# Altium schematic sheet CAN_USB_DISPLAY.SchDoc
size A; SheetNumber: 3; SheetTotal: 4
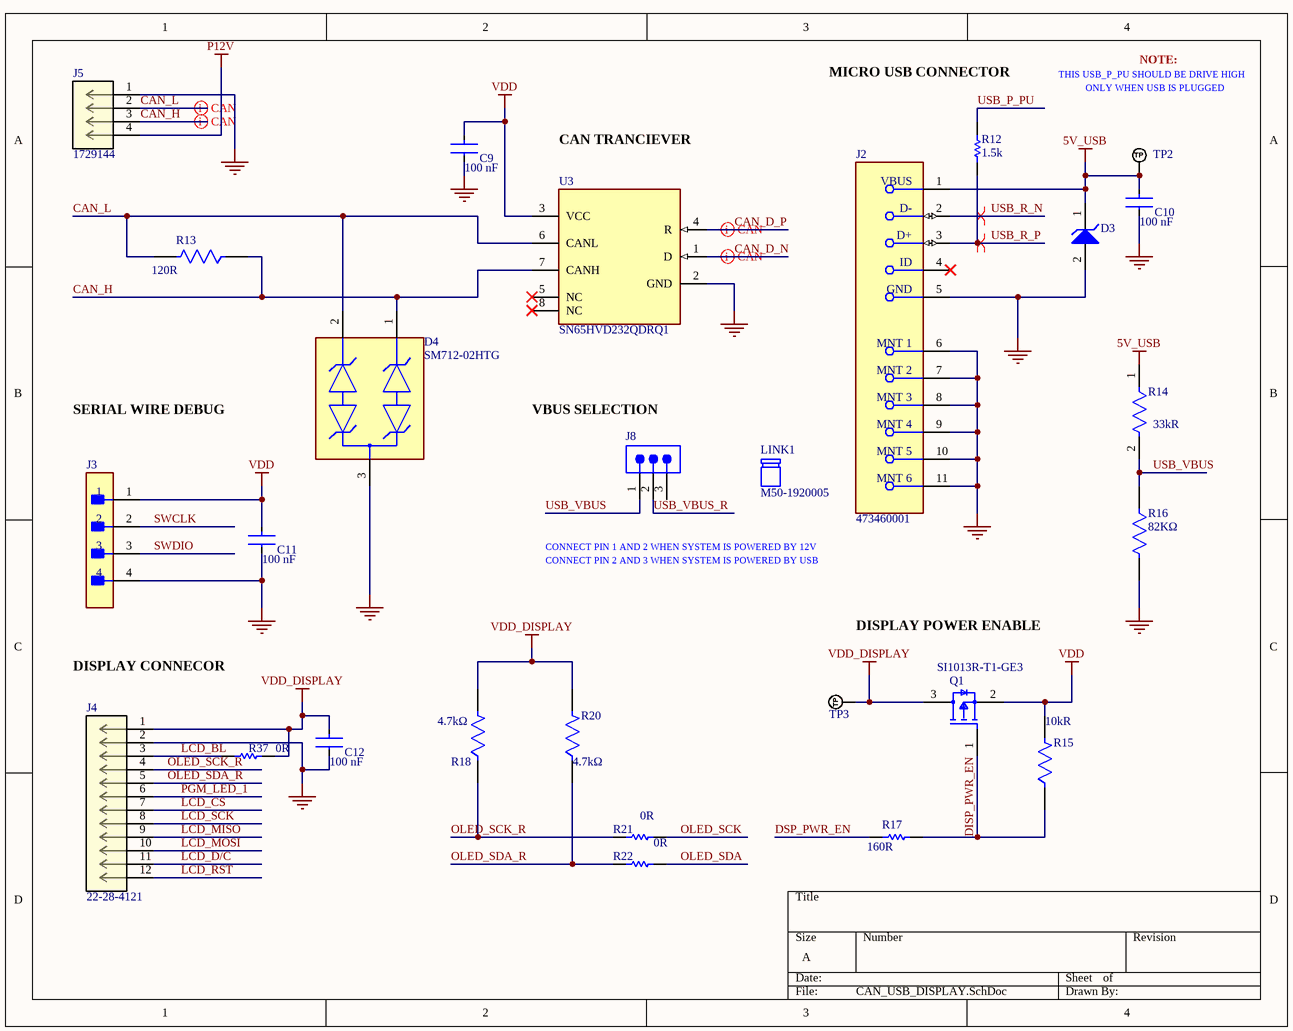
[diagram p0: CAN_USB_DISPLAY.SchDoc]

## Parts
C9  Capacitance: 100 nF  [FP-CC0402-MFG]  (hidden comment: CC0402KRX7R7BB104)
C10  Capacitance: 100 nF  [FP-CC0402-MFG]  (hidden comment: CC0402KRX7R7BB104)
C11  Capacitance: 100 nF  [FP-CC0402-MFG]  (hidden comment: CC0402KRX7R7BB104)
C12  Capacitance: 100 nF  [FP-CC0402-MFG]  (hidden comment: CC0402KRX7R7BB104)
D3  ESD5Z5.0T1G  [ONSC-SOD-523-2-502-01_V]  (value not drawn)
D4  SM712-02HTG  [FP-SM712-MFG]
J2  473460001  [FP-473460001-MFG]
J3  HTSW-104-07-G-S  [FP-HTSW-104-07-G-S-MFG]  (value not drawn)
J4  22-28-4121  [12 POS_2.54MM_MOLEX]
J5  1729144  [PHOENIX_1729144]
J8  61300311121  [61300311121]  (value not drawn)
LINK1  M50-1920005  (mechanical)
Q1  SI1013R-T1-GE3  [FP-C15-1445-MFG]
R12  Resistance: 1.5k  [RESC1005X40X25LL10T10]  (hidden comment: ERA2AEB152X)
R13  RESISTANCE: 120R  [FP-RMCF1206-MFG]  (hidden comment: RMCF1206FTR120)
R14  Resistance: 33kR  [FP-ERA2A-MFG]  (hidden comment: ERA-2AEB333X)
R15  Resistance: 10kR  [FP-RC0402-0_4-MFG]  (hidden comment: RC0402JR-0710KL)
R16  Resistance: 82KΩ  [FP-CRGCQ0402-IPC_C]  (hidden comment: CRGCQ0402F82K)
R17  Resistance: 160R  [RESC1005X40X25NL05T05]  (hidden comment: ERJ-2GEJ161X)
R18  Resistance: 4.7kΩ  [FP-RC0402-0_4-MFG]  (hidden comment: RC0402JR-074K7L)
R20  Resistance: 4.7kΩ  [FP-RC0402-0_4-MFG]  (hidden comment: RC0402JR-074K7L)
R21  Resistance: 0R  [RESC1005X40X25LL05T05]  (hidden comment: ERJ2GE0R00X)
R22  Resistance: 0R  [RESC1005X40X25LL05T05]  (hidden comment: ERJ2GE0R00X)
R37  Resistance: 0R  [RESC1005X40X25LL05T05]  (hidden comment: ERJ2GE0R00X)
TP2  TP_NOBOM  [PAD_RND_1MM]  (value not drawn)  (no BOM)
TP3  TP_NOBOM  [PAD_RND_1MM]  (value not drawn)  (no BOM)
U3  SN65HVD232QDRQ1  [CAN IC]

## Nets
5V_USB: C10.1 D3.1(K) J2.1(VBUS) R14.1 TP2.1(TP)
GND: C9.2 C10.2 C11.2 C12.2 D3.2(A) D4.3 J2.5(GND) J2.6(MNT_1) J2.7(MNT_2) J2.8(MNT_3) J2.9(MNT_4) J2.10(MNT_5) J2.11(MNT_6) J3.4 J4.2 J5.1 R16.2 U3.2(GND)
P12V: J5.4
VDD: C9.1 C11.1 J3.1 Q1.2(S) R15.2 U3.3(VCC)
VDD_DISPLAY: C12.1 J4.1 Q1.3(D) R18.2 R20.2 R37.2 TP3.1(TP)
CAN_D_N: U3.1(D)
CAN_D_P: U3.4(R)
CAN_H: D4.1 J5.3 R13.1 U3.7(CANH)
CAN_L: D4.2 J5.2 R13.2 U3.6(CANL)
DISP_PWR_EN: Q1.1(G) R15.1 R17.2
DSP_PWR_EN: R17.1
LCD_BL: J4.3 R37.1
LCD_CS: J4.7
LCD_D/C: J4.11
LCD_MISO: J4.9
LCD_MOSI: J4.10
LCD_RST: J4.12
LCD_SCK: J4.8
OLED_SCK: R21.2
OLED_SCK_R: J4.4 R18.1 R21.1
OLED_SDA: R22.2
OLED_SDA_R: J4.5 R20.1 R22.1
PGM_LED_1: J4.6
SWCLK: J3.2
SWDIO: J3.3
USB_P_PU: R12.2
USB_R_N: J2.2(D-)
USB_R_P: J2.3(D+) R12.1
USB_VBUS: J8.1 R14.2 R16.1
USB_VBUS_R: J8.2

Not connected (* = marked no-connect by the designer): J2 4(ID)*; J8 3; U3 5(NC)* 8(NC)*

## Layout directives
differential pair; differential pair class DIFF USB: USB_R_N, USB_R_P
differential pair; DIFF PAIR CLASS NAME: DIFF CAN: CAN_D_N, CAN_D_P, CAN_H, CAN_L

## Notes on the sheet
- MICRO USB CONNECTOR
- THIS USB_P_PU SHOULD BE DRIVE HIGH
- ONLY WHEN USB IS PLUGGED
- NOTE:
- CAN TRANCIEVER
- SERIAL WIRE DEBUG
- VBUS SELECTION
- CONNECT PIN 1 AND 2 WHEN SYSTEM IS POWERED BY 12V
- CONNECT PIN 2 AND 3 WHEN SYSTEM IS POWERED BY USB
- DISPLAY POWER ENABLE
- DISPLAY CONNECOR

## Library data of the parts
C9-C12 = CMP-03422-000048-1: CAP CER 0.1UF 16V X7R 0402; Manufacturer: YAGEO; Material: Ceramic; Automotive Grade: NA; Temperature Coefficient: 30ppm/°C; Tolerance: 0.1; Value: 100 nF; Device Class L1: Passive Components; Temperature Range Low: -55°C; Device Class L3: Ceramic Capacitors; Temperature Characteristic: X7R; Ipc Land Pattern Name: CAPC10050X50; Temperature Range High: +125°C; Voltage Rating: 16 V; Temperature: -55°C to +125°C; RoHS: TRUE; Automotive: No; Height: 0.55mm; Device Class L2: Capacitors; Digikey Description: CAP CER 0.1UF 16V X7R 0402; Package: CC0402; Footprint Url: http://www.yageo.com/exep/pages/download/literatures/UPY-C_GEN_24.pdf; ComponentLink2Description: Datasheet; Category: Cap; Lead Free: Yes; Octopart: https://octopart.com/cc0402krx7r7bb104-yageo-42244624; ComponentLink2URL: http://www.yageo.com/documents/recent/UPY-GP_NP0_16V-to-50V_16.pdf; Manufacturer Part Number: CC0402KRX7R7BB104; Mouser Description: 0402 0.1 uF 16 V ±10 % Tolerance X7R SMT Multilayer Ceramic Capacitor
D3 = CMP-1063-00102-1: Transient Voltage Suppressor, Micro-Packaged Diode for ESD Protection, 2-Pin SOD-523, Pb-Free, Tape and Reel; Manufacturer: On Semiconductor; V(BR) Min (V): 6.2; VRWM Max (V): 5; Number of Lines: 1; PPK Max (W): 174; IR Max (uA): 0.05; Direction: Unidirectional; PackageVersion: Rev. E, 09/2010; Mounting Technology: Surface Mount; Packing: Tape and Reel; ComponentLink2URL: http://www.onsemi.cn/pub_link/Collateral/ESD5Z2.5T1-D.PDF; ComponentLink2Description: Datasheet; PackageReference: SOD-523-2-502-01; ComponentLink1Description: Manufacturer URL; ComponentLink3URL: http://www.onsemi.com/pub_link/Collateral/502-01.PDF; PackageDescription: 2-Pin SOD, Body 1.2 x 0.8 mm; ComponentLink3Description: Package Specification; ComponentLink1URL: http://www.onsemi.com/; RoHS: Pb-Free; PartNumber: ESD5Z5.0T1G; DatasheetVersion: Rev. 10
D4 = CMP-2000-07561-2: TVS DIODE 12V 31V SOT23-3; Leakage Current: 20uA; Polarity: Bidirectional; Breakdown Voltage: 13.3V; Max Power Dissipation: 600W; Number of Channels: 2; Max Surge Current: 19A; Capacitance: 75pF; Power Line Protection: No; Element Configuration: Dual; Number of Pins: 3; Radiation Hardening: No; Clamping Voltage: 31V; Mount: Surface Mount; Reverse Standoff Voltage: 12V; Peak Pulse Power: 600W; Lead Free: Lead Free; Direction: Bidirectional; Packaging: Tape and Reel; Case/Package: SOT-23-3; Number of Bidirectional Channels: 2; Termination: SMD/SMT; Max Operating Temperature: 125°C; Min Breakdown Voltage: 13.3V; Depth: 1.4mm; Package Quantity: 3000; Working Voltage: 12V; Length: 3.04mm; Peak Pulse Current: 19A; Composition: Zener; Min Operating Temperature: -40°C
J2 = CMP-2000-05246-2: CONN RCPT USB2.0 MICRO B SMD R/A; Manufacturer: Molex; Conn Orientation: Right Angle; Is Female: yes; Shielding: true; Pitch: 0.65mm; Number Of Contacts: 5; Voltage Rating: 30V; Current Rating: 1.8A; Device Class L2: USB Connectors; Digikey Description: CONN RCPT USB2.0 MICRO B SMD R/A; Height: 2.945mm; RoHS: TRUE; ComponentLink2Description: Datasheet; Octopart: https://octopart.com/47346-0001-molex-7164928; Automotive: No; Package: 0; Category: Conn; Device Class L1: Connectors; Usb Standard: USB 2.0; Temperature: -30°C to +85°C; Temperature Range Low: -30°C; Footprint Url: https://www.molex.com/pdm_docs/sd/473460001_sd.pdf; ComponentLink2URL: https://www.molex.com/webdocs/datasheets/pdf/en-us/0473460001_IO_CONNECTORS.pdf; Lead Free: Yes; Manufacturer Part Number: 473460001; Contact Material: Gold,Nickel; Temperature Range High: +85°C; Device Class L3: unset
J3 = CMP-02766-001776-1: CONN HEADER VERT 4POS 2.54MM; Gender: Male; Number of Contacts: 4; Packaging: Bulk; RoHS Compliant: Yes; Number of Rows: 1; Mount: Through Hole; Contact Material: Bronze; Series: HTSW; Radiation Hardening: No; Pitch: 2.54mm; Reach SVHC Compliant: Yes; Contact Plating: Gold; Termination: Through Hole
J4 = 22-28-4121: KK 254 Breakaway Header, Vertical, 12 Circuits, Tin (Sn) Plating, Mating Pin Length 8.13mm; Manufacturer: Molex; Manufacturer Lifecycle Status: ACTIVE; Connector Type: Male Pin; Contact Resistance: 20mΩ; Current Rating: 4A; Gender: Male; Insulation Resistance: 50GΩ; Max Voltage Rating (AC): 250V; Number of Circuits: 12; Pitch: 2.54mm; Supplier: Farnell; Supplier Part Number: 4232426; Manufacturer Part Number: 22-28-4121; RoHS: Compliant; Category: Headers and Wire Housings; Stock: 4391; Pricing: 300=0.506, 900=0.491 (EUR); China RoHS: Compliant; Color: Black; Contact Gender: Male; Contact Material: Bronze; Contact Mating Length: 8.128mm; Contact Plating: Tin; Country of Origin: US; Depth: 2.49mm; Housing Color: Black; Housing Material: Thermoplastic; Lead Free: Lead Free; Length: 30.48mm; Lifecycle Status: Production; Max Operating Temperature: 75°C; Min Operating Temperature: -40°C; Mounting Technology: Through Hole; Number of Contacts: 12; Pins: 12; Number of Positions: 12; Number of Rows: 1; Orientation: Vertical; Packaging: Bulk; Plating: Tin; REACH SVHC: Yes; Terminal Pitch: 2.54mm; Termination: Solder; ComponentLink1URL: https://datasheet.octopart.com:443/22-28-4121-Molex-datasheet-166051265.pdf?src-supplier=IHS; ComponentLink1Description: https://datasheet.octopart.com:443/22-28-4121-Molex-datasheet-166051265.pdf?src-supplier=IHS; ComponentLink2URL: https://datasheet.octopart.com:443/22-28-4121-Molex-datasheet-16300599.pdf?src-supplier=Molex; ComponentLink2Description: https://datasheet.octopart.com:443/22-28-4121-Molex-datasheet-16300599.pdf?src-supplier=Molex; ComponentLink3URL: https://sigma.octopart.com:443/16300370/technical_drawing/Molex-22-28-4121.pdf?src-supplier=Molex; ComponentLink3Description: https://sigma.octopart.com:443/16300370/technical_drawing/Molex-22-28-4121.pdf?src-supplier=Molex; ComponentLink4URL: https://datasheet.octopart.com:443/022284121-Molex-datasheet-8334776.pdf?src-supplier=Molex; ComponentLink4Description: https://datasheet.octopart.com:443/022284121-Molex-datasheet-8334776.pdf?src-supplier=Molex; ComponentLink5URL: https://datasheet.octopart.com:443/22-28-4121-Molex-datasheet-147975.pdf?src-supplier=DigiKey; ComponentLink5Description: https://datasheet.octopart.com:443/22-28-4121-Molex-datasheet-147975.pdf?src-supplier=DigiKey; ComponentLink6URL: http://sigma.octopart.com:80/16300600/rohs_statement/Molex-22-28-4121.pdf?src-supplier=Compliance+Statements; ComponentLink6Description: http://sigma.octopart.com:80/16300600/rohs_statement/Molex-22-28-4121.pdf?src-supplier=Compliance+Statements; ComponentLink7URL: http://sigma.octopart.com:80/conflict_mineral_statement/Molex-company-72.pdf?src-supplier=Compliance+Statements; ComponentLink7Description: http://sigma.octopart.com:80/conflict_mineral_statement/Molex-company-72.pdf?src-supplier=Compliance+Statements; ComponentLink8URL: http://sigma.octopart.com:80/rohs_statement/Molex-company-73.pdf?src-supplier=Compliance+Statements; ComponentLink8Description: http://sigma.octopart.com:80/rohs_statement/Molex-company-73.pdf?src-supplier=Compliance+Statements; ComponentLink9URL: http://sigma.octopart.com:80/reach_statement/Molex-company-74.pdf?src-supplier=Compliance+Statements; ComponentLink9Description: http://sigma.octopart.com:80/reach_statement/Molex-company-74.pdf?src-supplier=Compliance+Statements
J5 = 1729144: Block, Terminal; 13.5 A; 250 V; 5.08 mm; 26 to 16 AWG; 4; Screw; Solder; 4 kV; Manufacturer: Phoenix Contact; Approvals: CB, CSA, cUL; Current: 10A; Current Rating: 13.5A; Max Supply Voltage: 250V; Number of Circuits: 4; Number of Levels: 1; Pitch: 5.08mm; Stripping Length: 6mm; Test Voltage: 4kV; Voltage: 300V; Voltage Rating: 400V; Wire/Cable Gauge: 16AWG; Wire Gauge (Max): 26AWG; Supplier: RS; Supplier Part Number: 2901264; Manufacturer Part Number: 1729144; RoHS: Compliant; Category: Terminal Blocks; Stock: 210; Pricing: 5=1.936, 125=1.748, 375=1.65, 1000=1.462, 2000=1.352 (EUR); China RoHS: Compliant; Color: Green; Connector Type: Screw; Contact Material: Tin; Depth: 8.1mm; Flammability Rating: UL94 V-0; Height: 10.15mm; Housing Color: Green; Insulation Material: Nylon; Lead Free: Lead Free; Lead Pitch: 5.08mm; Length: 20.32mm; Lifecycle Status: Production; Max Current Rating: 13.5A; Max Operating Temperature: 100°C; Min Operating Temperature: -20°C; Mounting Technology: Screw; Number of Contacts: 4; Pins: 4; Number of Poles: 4; Number of Positions: 4; Number of Positions Per Level: 4; Number of Rows: 1; Orientation: Straight; Packaging: Bulk; Radiation Hardening: No; REACH SVHC: No; Termination: Screw; Voltage Rating (AC): 250V; Weight: 3.679995g; Width: 10mm; Wire Gauge (Min): 26AWG; ComponentLink1URL: https://datasheet.octopart.com:443/1729144-Phoenix-Contact-datasheet-181074908.pdf?src-supplier=IHS; ComponentLink1Description: https://datasheet.octopart.com:443/1729144-Phoenix-Contact-datasheet-181074908.pdf?src-supplier=IHS; ComponentLink2URL: https://datasheet.octopart.com:443/1729144-Phoenix-Contact-datasheet-83960592.pdf?src-supplier=element14+APAC; ComponentLink2Description: https://datasheet.octopart.com:443/1729144-Phoenix-Contact-datasheet-83960592.pdf?src-supplier=element14+APAC; ComponentLink3URL: https://datasheet.octopart.com:443/1729144-Phoenix-Contact-datasheet-20682991.pdf?src-supplier=Newark; ComponentLink3Description: https://datasheet.octopart.com:443/1729144-Phoenix-Contact-datasheet-20682991.pdf?src-supplier=Newark; ComponentLink4URL: https://datasheet.octopart.com:443/1729144-Phoenix-Contact-datasheet-21212956.pdf?src-supplier=Newark; ComponentLink4Description: https://datasheet.octopart.com:443/1729144-Phoenix-Contact-datasheet-21212956.pdf?src-supplier=Newark; ComponentLink5URL: https://datasheet.octopart.com:443/1729144-Phoenix-Contact-datasheet-169855811.pdf?src-supplier=Master+Electronics; ComponentLink5Description: https://datasheet.octopart.com:443/1729144-Phoenix-Contact-datasheet-169855811.pdf?src-supplier=Master+Electronics; ComponentLink6URL: https://datasheet.octopart.com:443/1729144-Phoenix-Contact-datasheet-154778803.pdf?src-supplier=Electro+Sonic; ComponentLink6Description: https://datasheet.octopart.com:443/1729144-Phoenix-Contact-datasheet-154778803.pdf?src-supplier=Electro+Sonic; ComponentLink7URL: https://datasheet.octopart.com:443/1729144-Phoenix-Contact-datasheet-9657250.pdf?src-supplier=TodayComponents; ComponentLink7Description: https://datasheet.octopart.com:443/1729144-Phoenix-Contact-datasheet-9657250.pdf?src-supplier=TodayComponents; ComponentLink8URL: https://datasheet.octopart.com:443/1729144-Phoenix-Contact-datasheet-177321331.pdf?src-supplier=Burklin+Elektronik; ComponentLink8Description: https://datasheet.octopart.com:443/1729144-Phoenix-Contact-datasheet-177321331.pdf?src-supplier=Burklin+Elektronik; ComponentLink9URL: https://datasheet.octopart.com:443/1729144-Phoenix-Contact-datasheet-33458667.pdf?src-supplier=MRO+Stop; ComponentLink9Description: https://datasheet.octopart.com:443/1729144-Phoenix-Contact-datasheet-33458667.pdf?src-supplier=MRO+Stop; ComponentLink10URL: https://datasheet.octopart.com:443/1729144-Phoenix-Contact-datasheet-11779056.pdf?src-supplier=Arrow+Electronics; ComponentLink10Description: https://datasheet.octopart.com:443/1729144-Phoenix-Contact-datasheet-11779056.pdf?src-supplier=Arrow+Electronics; ComponentLink11URL: https://datasheet.octopart.com:443/1729144-Phoenix-Contact-datasheet-62122477.pdf?src-supplier=RS+(Formerly+Allied+Electronics); ComponentLink11Description: https://datasheet.octopart.com:443/1729144-Phoenix-Contact-datasheet-62122477.pdf?src-supplier=RS+(Formerly+Allied+Electronics); ComponentLink12URL: https://datasheet.octopart.com:443/1729144-Phoenix-Contact-datasheet-100427.pdf?src-supplier=RS+(Formerly+Allied+Electronics); ComponentLink12Description: https://datasheet.octopart.com:443/1729144-Phoenix-Contact-datasheet-100427.pdf?src-supplier=RS+(Formerly+Allied+Electronics); ComponentLink13URL: https://datasheet.octopart.com:443/1729144-Phoenix-Contact-datasheet-7644.pdf?src-supplier=DigiKey; ComponentLink13Description: https://datasheet.octopart.com:443/1729144-Phoenix-Contact-datasheet-7644.pdf?src-supplier=DigiKey
J8 = CMP-1502-01062-3: CONN HEADER VERT 3POS 2.54MM; NexarPartId: 32855521; Current Rating: 3A; Voltage Rating: 250V; Number of Positions: 3; Contact Resistance: 20mΩ; Connector Type: Male Pin; Gender: Male; REACH SVHC: Unknown; Packaging: Bulk; Contact Material: Copper; Pitch: 2.54mm; Min Operating Temperature: -40°C; Number of Rows: 1; Orientation: Vertical; RoHS: Compliant; Contact Plating: Gold; Max Operating Temperature: 105°C; Mount: Through Hole; Height: 8.94mm; Operating Supply Voltage: 250V; Number of Pins: 3; Contact Mating Length: 5.9944mm; Number of Contacts: 3; Color: Black; Lead Free: Lead Free; Lead Pitch: 2.54mm; Termination: Solder
LINK1 = M50-1920005: CONN SHUNT 1.27MM RED; Manufacturer: Harwin; Manufacturer Series: M50; Connector Type: Interconnection Device; Body/Shell Style: PLUG; Contact Pattern: RECTANGULAR; Contact Resistance: 20mR; Durability: 300Cycles; Insulation Resistance: 1GR; Number Of Connectors: 1; Rated Current (Signal): 1A; Number of Contacts: 2; Dielectric Withstanding Voltage (AC): 500V; Body Breadth: 0.059inch; Body Length: 0.098inch; Mating Contact Pitch: 0.05inch; Body Depth: 0.118inch; Reference Standard: UL; Reliability: COMMERCIAL; Supplier: Digikey; Supplier Part Number: 952-1727-ND; Manufacturer Part Number: M50-1920005; RoHS: Yes; Category: Headers and Wire Housings; Stock: 4401; Pricing: 1=0.43, 10=0.363, 25=0.3196, 50=0.2936, 100=0.2821, 250=0.25332, 500=0.2418, 1000=0.2015, 2500=0.18422 (USD); Contact Finish - Mating: AU ON NI; Contact Finish - Termination: Gold (Au); Insulation Color: Red; Insulation Material: Nylon; Contact Material: Copper Alloy; Min Operating Temperature: -40°C; Max Operating Temperature: 105°C; JESD-609 Code: e4; Contact Gender: Female; Mounting Style: STRAIGHT; Number of Rows Loaded: 1; Reach SVHC Compliant: Yes; RoHS Compliant: Yes; ComponentLink1URL: https://datasheet.ciiva.com:443/pdfs/VipMasterIC/IC/HRWN/HRWNS04645/HRWNS04645-1.pdf?src-supplier=IHS+Markit; ComponentLink1Description: https://datasheet.ciiva.com:443/pdfs/VipMasterIC/IC/HRWN/HRWNS04645/HRWNS04645-1.pdf?src-supplier=IHS+Markit; ComponentLink2URL: https://datasheet.ciiva.com/4573/m50-19x-350826-4573042.pdf?src-supplier=Mouser; ComponentLink2Description: https://datasheet.ciiva.com/4573/m50-19x-350826-4573042.pdf?src-supplier=Mouser; ComponentLink3URL: https://datasheet.ciiva.com/1412/1836978-1412125.pdf?src-supplier=Element14; ComponentLink3Description: https://datasheet.ciiva.com/1412/1836978-1412125.pdf?src-supplier=Element14; ComponentLink4URL: https://datasheet.ciiva.com/767/m50-19x-767921.pdf?src-supplier=Digikey; ComponentLink4Description: https://datasheet.ciiva.com/767/m50-19x-767921.pdf?src-supplier=Digikey; ComponentLink5URL: https://datasheet.ciiva.com/1456/m50-19x-1456640.pdf?src-supplier=Newark; ComponentLink5Description: https://datasheet.ciiva.com/1456/m50-19x-1456640.pdf?src-supplier=Newark; LCSC Part Number: C6985646
Q1 = CMP-02550-000328-1: MOSFET P-CH 20V 350MA SC75A; Turn-Off Delay Time: 35ns; Rds On Max: 1.2R; Drain to Source Voltage (Vdss): -20V; Number of Channels: 1; Polarization: P; Gate to Source Voltage (Vgs): 6V; Power Dissipation: 150mW; Rise Time: 9ns; Polarity: P-CHANNEL; Element Configuration: Single; Threshold Voltage: -450mV; Turn-On Delay Time: 5ns; Drain-source On Resistance-Max: 1.2R; Series: TrenchFET®; Packaging: Tape and Reel; Min Operating Temperature: -55°C; Number of Elements: 1; Height: 0.7mm; Drain to Source Resistance: 1.2R; Radiation Hardening: No; Continuous Drain Current (ID): 350mA; Width: 0.76mm; Case/Package: SOT-416; Length: 1.58mm; Max Operating Temperature: 150°C; Drain to Source Breakdown Voltage: -20V; Lead Free: Lead Free; Max Power Dissipation: 150mW; On-State Resistance: 1.2R; Mount: Surface Mount; Fall Time: 9ns; Reach SVHC Compliant: Yes; Number of Pins: 3; Package Quantity: 1
R12 = CMP-2002-05878-1: RES SMD 1.5K OHM 0.1% 1/16W 0402; Manufacturer: Panasonic; Part Number: ERA2AEB152X
R13 = CMP-26527-005834-1: 0.12Ω ±1% 0.25W 1206 Thick Film Chip Resistor AEC-Q200 compliant; Max Operating Temperature: 155°C; Min Operating Temperature: -55°C; Mount: Surface Mount; Tolerance: 1%; RoHS Compliant: Yes; Packaging: Tape and Reel
R14 = CMP-2002-05885-2: RES SMD 33K OHM 0.1% 1/16W 0402; Voltage Rating (DC): 25V; Max Power Dissipation: 63mW; Temperature Coefficient: 25ppm/°C; Voltage Rating: 50V; Series: ERA-2A; Construction: Rectangular; Military Standard: Not; Max Operating Temperature: 155°C; Contact Plating: Tin; Mount: Surface Mount; Technology: METAL FILM; Number of Terminations: 2; Resistance Tolerance: 0.1%; Case/Package: 0402; Termination: SMD/SMT; Length: 1mm; Height: 0.35mm; Case Code (Metric): 1005; Min Operating Temperature: -55°C; RoHS Compliant: Yes; Number of Pins: 2; Power Rating: 63mW; Resistor Type: Thin Film; Radiation Hardening: No; Lead Free: Lead Free; Width: 0.5mm; Packaging: Tape and Reel; Tolerance: 0.1%; Case Code (Imperial): 0402; Depth: 0.5mm; Package Quantity: 10000
R15 = CMP-2002-07915-3: RES 10K OHM 5% 1/16W 0402; Max Power Dissipation: 63mW; Temperature Coefficient: 100ppm/°C; Power Rating: 62.5mW; Voltage Rating: 50V; Size Code: 0402; Resistance Tolerance: 5%; Packaging: Tape and Reel; Case Code (Metric): 1005; Lead Free: Lead Free; Resistor Type: Thick Film; Min Operating Temperature: -55°C; Military Standard: Not; Depth: 0.5mm; Series: RC; Case/Package: 0402; Construction: Rectangular; Number of Terminations: 2; Package Quantity: 1; Termination: SMD/SMT; Length: 0.039inch; Case Code (Imperial): 0402; Height: 0.016inch; Features: Moisture Resistant; RoHS Compliant: Yes; Max Operating Temperature: 155°C; Tolerance: 5%; Width: 0.02inch
R16 = CMP-03211-009791-1: CRGCQ0402 82KΩ 1% ±100ppm/°C 50V; Manufacturer: TE Connectivity; Tolerance: 0.01; Power Rating: 0.0625W; Manufacturer Part Number: CRGCQ0402F82K; ComponentLink2Description: Datasheet; ComponentLink2URL: https://www.te.com/commerce/DocumentDelivery/DDEController?Action=showdoc&DocId=Data+Sheet%7F1773204-3%7F1%7Fpdf%7FEnglish%7FENG_DS_1773204-3_1.pdf%7F4-2176347-1130; Ipc Land Pattern Name: RESC10050X35; Ambient Temperature Range High: +70°C; RoHS: TRUE; Temperature Range High: +155°C; Temperature Coefficient: ±100ppm/°C; Device Class L3: Chip SMD Resistors; Voltage Rating: 50V; Temperature: -55°C to +155°C; Category: Res; Height: 0.4mm; Automotive: Yes; Octopart: https://octopart.com/crgcq0402f82k-te+connectivity-91017988; Package: CRGCQ0402; Device Class L1: Passive Components; Lead Free: Yes; Temperature Range Low: -55°C; Composition: Thick Film; Series: CRGCQ; Value: 82KΩ; Device Class L2: Resistors
R17 = CMP-2002-00462-1: Manufacturer: Panasonic; Part Number: ERJ-2GEJ161X
R18 R20 = CMP-2002-08011-2: 4.7 kOhms ±5% 0.063W, 1/16W Chip Resistor 0402 (1005 Metric) Moisture Resistant Thick Film; Power Rating: 63mW; Voltage Rating: 50V; Temperature Coefficient: 100ppm/°C; Composition: Thick Film; Tolerance: 5%; Max Operating Temperature: 155°C; Case/Package: 0402; Depth: 500µm; Packaging: Tape & Reel; Number of Pins: 2; Schedule B: 8533210045, 8533210045; Case Code (Imperial): 0402; Termination: SMD/SMT; Military Standard: Not; Lead Free: Lead Free; Width: 500µm; REACH SVHC: No SVHC; Max Power Dissipation: 63mW; Voltage Rating (AC): 50V; Features: Moisture Resistant; Min Operating Temperature: -55°C; Number of Terminations: 2; RoHS: Compliant; Height: 350µm; Voltage Rating (DC): 50V; Length: 1mm
R21 R22 R37 = CMP-2000-07451-1: Chip Resistor, 0 Ohm, 0.1 W, -55 to 155 degC, 0402 (1005 Metric), RoHS, Tape and Reel; Manufacturer: Panasonic; Voltage Rating (DC): 50V; Temperature Coefficient: 600ppm/��C; Max Power Dissipation: 100mW; Tolerance: 5%; Number of Terminations: 2; Mount: SurfaceMount; Height: 0.35mm; Packaging: TapeandReel; Contact Plating: Tin; Manufacturer URL: http://www.panasonic.com/; Composition: ThickFilm; Max Operating Temperature: 155degC; REACH SVHC: NoSVHC; Case/Package: 0402; Package Reference: 402; Depth: 0.5mm; Package Description: 2-Pin Surface Mount Device, Body 1 x 0.5 mm; Datasheet URL: https://industrial.panasonic.com/cdbs/www-data/pdf/RDA0000/AOA0000C301.pdf; RoHSCompliant: True; Case Code (Imperial): 0402; Military Standard: Not; Min Operating Temperature: -55degC; Power Rating: 100mW; Datasheet Version: 03/2015; Length: 1mm; Case Code (Metric): 1005; Termination: SMD/SMT; Mounting Technology: SurfaceMount; Voltage Rating: 50V; Width: 0.02inch; Package Quantity: 1; Lead Free: LeadFree; Radiation Hardening: No; Parameter 1: *
TP2 TP3 = TEST_POINT_RND_1MM: Test Point Round 1mm (NO BOM)
U3 = SN65HVD232QDRQ1: Texas Instruments - SN65HVD232QDRQ1 - Can Bus, Transceiver, Can, 1, 1, 3 V, 3.6 V, SOIC; Manufacturer Lifecycle Status: ACTIVE; Data Rate: 1Mbps; Max Supply Current: 17mA; Max Supply Voltage: 3.6V; Min Supply Voltage: 3V; Nominal Supply Current: 10mA; Number of Drivers: 1; Operating Supply Voltage: 3.3V; Supplier: DigiKey; Supplier Part Number: 296-15381-1-ND; Manufacturer: Texas Instruments; Manufacturer Part Number: SN65HVD232QDRQ1; RoHS: Compliant; Category: CAN Transceivers; Stock: 5233; Pricing: 1=2.53, 10=1.882, 25=1.7204, 100=1.542, 250=1.45696, 500=1.40572, 1000=1.36355 (USD); Ambient Temperature Range High: 125°C; Case/Package: SOIC; Contact Plating: Gold; Height: 1.75mm; Interface: CAN; Lead Free: Lead Free; Length: 4.9mm; Lifecycle Status: Production; Max Operating Temperature: 125°C; Min Operating Temperature: -40°C; Mounting Technology: Surface Mount; Pins: 8; Number of Receive Buffers: 1; Number of Transceivers: 1; Number of Transmit Buffers: 1; Radiation Hardening: No; REACH SVHC: No; Schedule B: 8542390000, 8542390000|8542390000|8542390000|8542390000|8542390000; Thickness: 1.58mm; Weight: 80.002354mg; Width: 3.91mm; ComponentLink1URL: https://octopart.com:443/opatz8j6/c1?t=LITAgAgz7B7QdaI9Qt2HgjoOmCu10XyqoYNHrwpusWZQVAPjgkmSFEF_risBrFxYo7pRufx3DEyy-N2gHphhBbY-O2brPGwBF0qWRDZBJwKpc8vz7NpKSZYmgFurZzREfPeTPNY--uS1FGiQhAQrSt4zcAPh1I7_MFqUNujoR0GcOpyZmo-pl9rdjnllxDCclFCKWB0voRrbvMpqWNAUQ8_CUMXod7jJBc2QYEMrdlZ29hcqAraiQu_d7e2TY7iSXt3xUmcpQy3q8KC-DM-dgBTcyvd1Ne-Gppd1cBkfaDw_Hz75aMDp-mAqQ1vF_U4SwwQFJ6tBaMhfxI2bAF_CCtHKrOx3ejVdVy91kaUfrzlkSVnoyQmpLArEwGXVjVjJpcLj4gC98fsP&src-supplier=Texas+Instruments; ComponentLink1Description: https://octopart.com:443/opatz8j6/c1?t=LITAgAgz7B7QdaI9Qt2HgjoOmCu10XyqoYNHrwpusWZQVAPjgkmSFEF_risBrFxYo7pRufx3DEyy-N2gHphhBbY-O2brPGwBF0qWRDZBJwKpc8vz7NpKSZYmgFurZzREfPeTPNY--uS1FGiQhAQrSt4zcAPh1I7_MFqUNujoR0GcOpyZmo-pl9rdjnllxDCclFCKWB0voRrbvMpqWNAUQ8_CUMXod7jJBc2QYEMrdlZ29hcqAraiQu_d7e2TY7iSXt3xUmcpQy3q8KC-DM-dgBTcyvd1Ne-Gppd1cBkfaDw_Hz75aMDp-mAqQ1vF_U4SwwQFJ6tBaMhfxI2bAF_CCtHKrOx3ejVdVy91kaUfrzlkSVnoyQmpLArEwGXVjVjJpcLj4gC98fsP&src-supplier=Texas+Instruments; ComponentLink2URL: https://datasheet.octopart.com:443/SN65HVD232QDRQ1-Texas-Instruments-datasheet-10256965.pdf?src-supplier=Texas+Instruments; ComponentLink2Description: https://datasheet.octopart.com:443/SN65HVD232QDRQ1-Texas-Instruments-datasheet-10256965.pdf?src-supplier=Texas+Instruments; ComponentLink3URL: https://sigma.octopart.com:443/49249642/technical_drawing/Texas-Instruments-SN65HVD232QDRQ1.pdf?src-supplier=Texas+Instruments; ComponentLink3Description: https://sigma.octopart.com:443/49249642/technical_drawing/Texas-Instruments-SN65HVD232QDRQ1.pdf?src-supplier=Texas+Instruments; ComponentLink4URL: https://datasheet.octopart.com:443/SN65HVD232QDRQ1-Texas-Instruments-datasheet-147837789.pdf?src-supplier=Upverter; ComponentLink4Description: https://datasheet.octopart.com:443/SN65HVD232QDRQ1-Texas-Instruments-datasheet-147837789.pdf?src-supplier=Upverter; ComponentLink5URL: https://datasheet.octopart.com:443/SN65HVD232QDRQ1-Texas-Instruments-datasheet-37726331.pdf?src-supplier=Farnell; ComponentLink5Description: https://datasheet.octopart.com:443/SN65HVD232QDRQ1-Texas-Instruments-datasheet-37726331.pdf?src-supplier=Farnell; ComponentLink6URL: https://datasheet.octopart.com:443/SN65HVD232QDRQ1-Texas-Instruments-datasheet-33010704.pdf?src-supplier=element14+APAC; ComponentLink6Description: https://datasheet.octopart.com:443/SN65HVD232QDRQ1-Texas-Instruments-datasheet-33010704.pdf?src-supplier=element14+APAC; ComponentLink7URL: https://datasheet.octopart.com:443/SN65HVD232QDRQ1-Texas-Instruments-datasheet-161336648.pdf?src-supplier=SHENGYU+ELECTRONICS; ComponentLink7Description: https://datasheet.octopart.com:443/SN65HVD232QDRQ1-Texas-Instruments-datasheet-161336648.pdf?src-supplier=SHENGYU+ELECTRONICS; ComponentLink8URL: https://datasheet.octopart.com:443/SN65HVD232QDRQ1-Texas-Instruments-datasheet-17022122.pdf?src-supplier=Factory+Futures; ComponentLink8Description: https://datasheet.octopart.com:443/SN65HVD232QDRQ1-Texas-Instruments-datasheet-17022122.pdf?src-supplier=Factory+Futures; ComponentLink9URL: https://datasheet.octopart.com:443/SN65HVD232QDRQ1-Texas-Instruments-datasheet-14121572.pdf?src-supplier=iiiC; ComponentLink9Description: https://datasheet.octopart.com:443/SN65HVD232QDRQ1-Texas-Instruments-datasheet-14121572.pdf?src-supplier=iiiC; ComponentLink10URL: https://datasheet.octopart.com:443/SN65HVD232QDRQ1-Texas-Instruments-datasheet-47830.pdf?src-supplier=DigiKey; ComponentLink10Description: https://datasheet.octopart.com:443/SN65HVD232QDRQ1-Texas-Instruments-datasheet-47830.pdf?src-supplier=DigiKey; ComponentLink11URL: http://sigma.octopart.com:80/conflict_mineral_statement/Texas-Instruments-company-63.pdf?src-supplier=Compliance+Statements; ComponentLink11Description: http://sigma.octopart.com:80/conflict_mineral_statement/Texas-Instruments-company-63.pdf?src-supplier=Compliance+Statements; ComponentLink12URL: http://sigma.octopart.com:80/reach_statement/Texas-Instruments-company-64.pdf?src-supplier=Compliance+Statements; ComponentLink12Description: http://sigma.octopart.com:80/reach_statement/Texas-Instruments-company-64.pdf?src-supplier=Compliance+Statements